# EAGLE design osc (EAGLE 9.5.2)
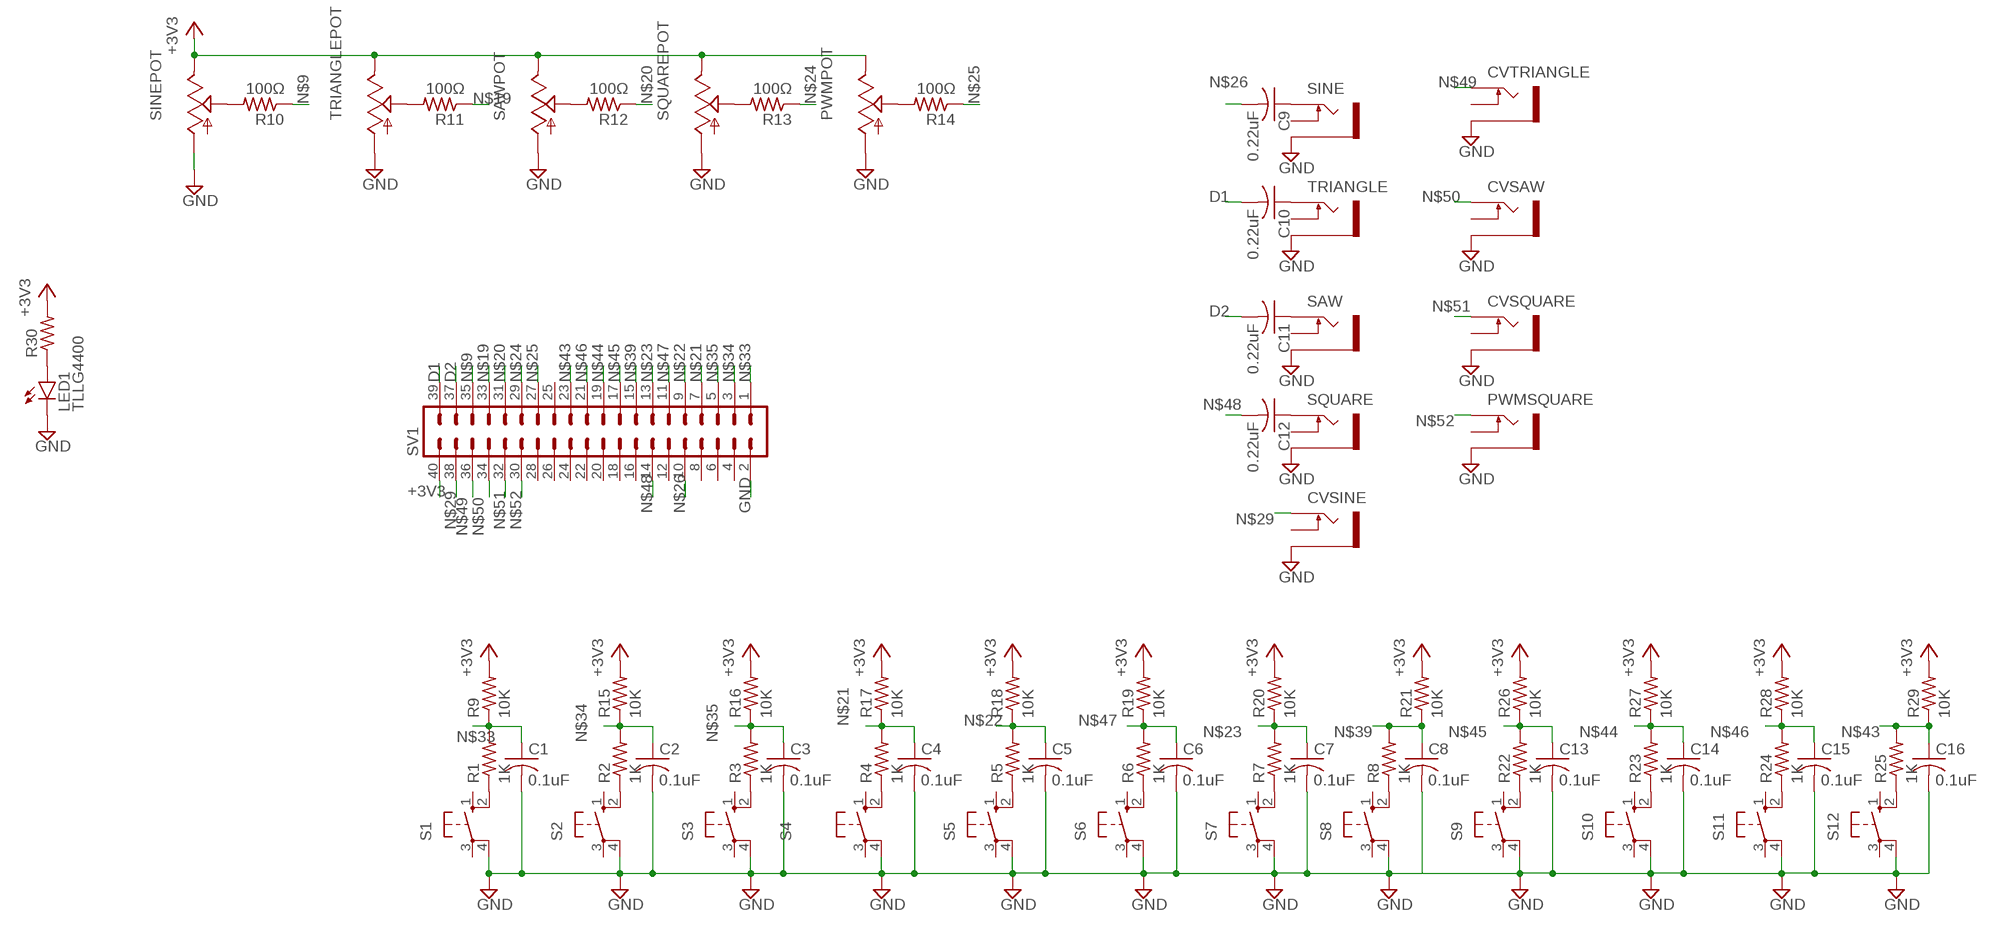
[diagram p0: schematic, sheet 1]

## Parts
C1  0.1uF  C-US025-024X044  [C025-024X044]
C2  0.1uF  C-US025-024X044  [C025-024X044]
C3  0.1uF  C-US025-024X044  [C025-024X044]
C4  0.1uF  C-US025-024X044  [C025-024X044]
C5  0.1uF  C-US025-024X044  [C025-024X044]
C6  0.1uF  C-US025-024X044  [C025-024X044]
C7  0.1uF  C-US025-024X044  [C025-024X044]
C8  0.1uF  C-US025-024X044  [C025-024X044]
C9  0.22uF  C-US025-024X044  [C025-024X044]
C10  0.22uF  C-US025-024X044  [C025-024X044]
C11  0.22uF  C-US025-024X044  [C025-024X044]
C12  0.22uF  C-US025-024X044  [C025-024X044]
C13  0.1uF  C-US025-024X044  [C025-024X044]
C14  0.1uF  C-US025-024X044  [C025-024X044]
C15  0.1uF  C-US025-024X044  [C025-024X044]
C16  0.1uF  C-US025-024X044  [C025-024X044]
CVSAW  THONKICONNNEW  [WQP-PJ301M-12_JACK]
CVSINE  THONKICONNNEW  [WQP-PJ301M-12_JACK]
CVSQUARE  THONKICONNNEW  [WQP-PJ301M-12_JACK]
CVTRIANGLE  THONKICONNNEW  [WQP-PJ301M-12_JACK]
LED1  TLLG4400  [LED3MM]
PWMPOT  9MM_SNAP-IN_POT_  [9MM_SNAP-IN_POT]
PWMSQUARE  THONKICONNNEW  [WQP-PJ301M-12_JACK]
R1  1K  R-US_0207/10  [0207/10]
R2  1K  R-US_0207/10  [0207/10]
R3  1K  R-US_0207/10  [0207/10]
R4  1K  R-US_0207/10  [0207/10]
R5  1K  R-US_0207/10  [0207/10]
R6  1K  R-US_0207/10  [0207/10]
R7  1K  R-US_0207/10  [0207/10]
R8  1K  R-US_0207/10  [0207/10]
R9  10K  R-US_0207/10  [0207/10]
R10  100Ω  R-US_0207/10  [0207/10]
R11  100Ω  R-US_0207/10  [0207/10]
R12  100Ω  R-US_0207/10  [0207/10]
R13  100Ω  R-US_0207/10  [0207/10]
R14  100Ω  R-US_0207/10  [0207/10]
R15  10K  R-US_0207/10  [0207/10]
R16  10K  R-US_0207/10  [0207/10]
R17  10K  R-US_0207/10  [0207/10]
R18  10K  R-US_0207/10  [0207/10]
R19  10K  R-US_0207/10  [0207/10]
R20  10K  R-US_0207/10  [0207/10]
R21  10K  R-US_0207/10  [0207/10]
R22  1K  R-US_0207/10  [0207/10]
R23  1K  R-US_0207/10  [0207/10]
R24  1K  R-US_0207/10  [0207/10]
R25  1K  R-US_0207/10  [0207/10]
R26  10K  R-US_0207/10  [0207/10]
R27  10K  R-US_0207/10  [0207/10]
R28  10K  R-US_0207/10  [0207/10]
R29  10K  R-US_0207/10  [0207/10]
R30  R-US_0207/10  [0207/10]
S1  10-XX  [B3F-10XX]
S2  10-XX  [B3F-10XX]
S3  10-XX  [B3F-10XX]
S4  10-XX  [B3F-10XX]
S5  10-XX  [B3F-10XX]
S6  10-XX  [B3F-10XX]
S7  10-XX  [B3F-10XX]
S8  10-XX  [B3F-10XX]
S9  10-XX  [B3F-10XX]
S10  10-XX  [B3F-10XX]
S11  10-XX  [B3F-10XX]
S12  10-XX  [B3F-10XX]
SAW  THONKICONNNEW  [WQP-PJ301M-12_JACK]
SAWPOT  9MM_SNAP-IN_POT_  [9MM_SNAP-IN_POT]
SINE  THONKICONNNEW  [WQP-PJ301M-12_JACK]
SINEPOT  9MM_SNAP-IN_POT_  [9MM_SNAP-IN_POT]
SQUARE  THONKICONNNEW  [WQP-PJ301M-12_JACK]
SQUAREPOT  9MM_SNAP-IN_POT_  [9MM_SNAP-IN_POT]
SV1  MA20-2  [MA20-2]
TRIANGLE  THONKICONNNEW  [WQP-PJ301M-12_JACK]
TRIANGLEPOT  9MM_SNAP-IN_POT_  [9MM_SNAP-IN_POT]

## Nets
+3V3: PWMPOT.3(E) R9.2 R15.2 R16.2 R17.2 R18.2 R19.2 R20.2 R21.2 R26.2 R27.2 R28.2 R29.2 R30.2 SAWPOT.3(E) SINEPOT.3(E) SQUAREPOT.3(E) SV1.40 TRIANGLEPOT.3(E)
D1: C10.2 SV1.39
D2: C11.2 SV1.37
GND: C1.2 C2.2 C3.2 C4.2 C5.2 C6.2 C7.2 C8.2 C13.2 C14.2 C15.2 C16.2 CVSAW.P$3_SLEEVE(SLEEVE) CVSINE.P$3_SLEEVE(SLEEVE) CVSQUARE.P$3_SLEEVE(SLEEVE) CVTRIANGLE.P$3_SLEEVE(SLEEVE) LED1.K(C) PWMPOT.1(A) PWMSQUARE.P$3_SLEEVE(SLEEVE) S1.4(P1) S2.4(P1) S3.4(P1) S4.4(P1) S5.4(P1) S6.4(P1) S7.4(P1) S8.4(P1) S9.4(P1) S10.4(P1) S11.4(P1) S12.4(P1) SAW.P$3_SLEEVE(SLEEVE) SAWPOT.1(A) SINE.P$3_SLEEVE(SLEEVE) SINEPOT.1(A) SQUARE.P$3_SLEEVE(SLEEVE) SQUAREPOT.1(A) SV1.2 TRIANGLE.P$3_SLEEVE(SLEEVE) TRIANGLEPOT.1(A)
N$1: R1.1 S1.2(S1)
N$2: R2.1 S2.2(S1)
N$3: R3.1 S3.2(S1)
N$4: R4.1 S4.2(S1)
N$5: R6.1 S6.2(S1)
N$6: R7.1 S7.2(S1)
N$7: R8.1 S8.2(S1)
N$8: R5.1 S5.2(S1)
N$9: R10.1 SV1.35
N$10: C9.1 SINE.P$1_TIP(TIP)
N$11: C10.1 TRIANGLE.P$1_TIP(TIP)
N$12: C11.1 SAW.P$1_TIP(TIP)
N$13: C12.1 SQUARE.P$1_TIP(TIP)
N$14: R10.2 SINEPOT.2(S)
N$15: R11.2 TRIANGLEPOT.2(S)
N$16: R12.2 SAWPOT.2(S)
N$17: R13.2 SQUAREPOT.2(S)
N$18: PWMPOT.2(S) R14.2
N$19: R11.1 SV1.33
N$20: R12.1 SV1.31
N$21: C4.1 R4.2 R17.1 SV1.7
N$22: C5.1 R5.2 R18.1 SV1.9
N$23: C7.1 R7.2 R20.1 SV1.13
N$24: R13.1 SV1.29
N$25: R14.1 SV1.27
N$26: C9.2 SV1.10
N$27: LED1.A R30.1
N$29: CVSINE.P$1_TIP(TIP) SV1.38
N$33: C1.1 R1.2 R9.1 SV1.1
N$34: C2.1 R2.2 R15.1 SV1.3
N$35: C3.1 R3.2 R16.1 SV1.5
N$38: R23.1 S10.2(S1)
N$39: C8.1 R8.2 R21.1 SV1.15
N$40: R24.1 S11.2(S1)
N$41: R25.1 S12.2(S1)
N$42: R22.1 S9.2(S1)
N$43: C16.1 R25.2 R29.1 SV1.23
N$44: C14.1 R23.2 R27.1 SV1.19
N$45: C13.1 R22.2 R26.1 SV1.17
N$46: C15.1 R24.2 R28.1 SV1.21
N$47: C6.1 R6.2 R19.1 SV1.11
N$48: C12.2 SV1.14
N$49: CVTRIANGLE.P$1_TIP(TIP) SV1.36
N$50: CVSAW.P$1_TIP(TIP) SV1.34
N$51: CVSQUARE.P$1_TIP(TIP) SV1.32
N$52: PWMSQUARE.P$1_TIP(TIP) SV1.30
Unconnected: CVSAW.P$2_SWITCH(SWITCH) CVSINE.P$2_SWITCH(SWITCH) CVSQUARE.P$2_SWITCH(SWITCH) CVTRIANGLE.P$2_SWITCH(SWITCH) PWMSQUARE.P$2_SWITCH(SWITCH) S1.1(S) S1.3(P) S2.1(S) S2.3(P) S3.1(S) S3.3(P) S4.1(S) S4.3(P) S5.1(S) S5.3(P) S6.1(S) S6.3(P) S7.1(S) S7.3(P) S8.1(S) S8.3(P) S9.1(S) S9.3(P) S10.1(S) S10.3(P) S11.1(S) S11.3(P) S12.1(S) S12.3(P) SAW.P$2_SWITCH(SWITCH) SINE.P$2_SWITCH(SWITCH) SQUARE.P$2_SWITCH(SWITCH) SV1.4 SV1.6 SV1.8 SV1.12 SV1.16 SV1.18 SV1.20 SV1.22 SV1.24 SV1.25 SV1.26 SV1.28 TRIANGLE.P$2_SWITCH(SWITCH)

## Library data of the parts
C1-C16 = rcl:C-US: CAPACITOR, American symbol; SPICEPREFIX: C
CVSAW CVSINE CVSQUARE CVTRIANGLE PWMSQUARE SAW SINE SQUARE TRIANGLE = MusicThingModular:THONKICONN: 3.5mm socket for Eurorack modular synths
LED1 = led:TLLG4400: Low Current (2mA) LED 3 mm Tinted Diffused Package color GREEN Source: Data sheet <http://www.farnell.com/datasheets/391098.pdf>; MF: VISHAY SEMICONDUCTOR; OC_FARNELL: 1612435
PWMPOT SAWPOT SINEPOT SQUAREPOT TRIANGLEPOT = MusicThingModular:9MM_SNAP-IN_POT: 9mm vertical snap-in pot, Alpha / Panasonic style
R1-R30 = rcl:R-US_: RESISTOR, American symbol; SPICEPREFIX: R
S1-S12 = switch-omron:10-XX: OMRON SWITCH; MPN: B3F-1000; OC_FARNELL: 176432; OC_NEWARK: 36M3542
SV1 = con-lstb:MA20-2: PIN HEADER; OC_FARNELL: unknown; OC_NEWARK: unknown

## Board
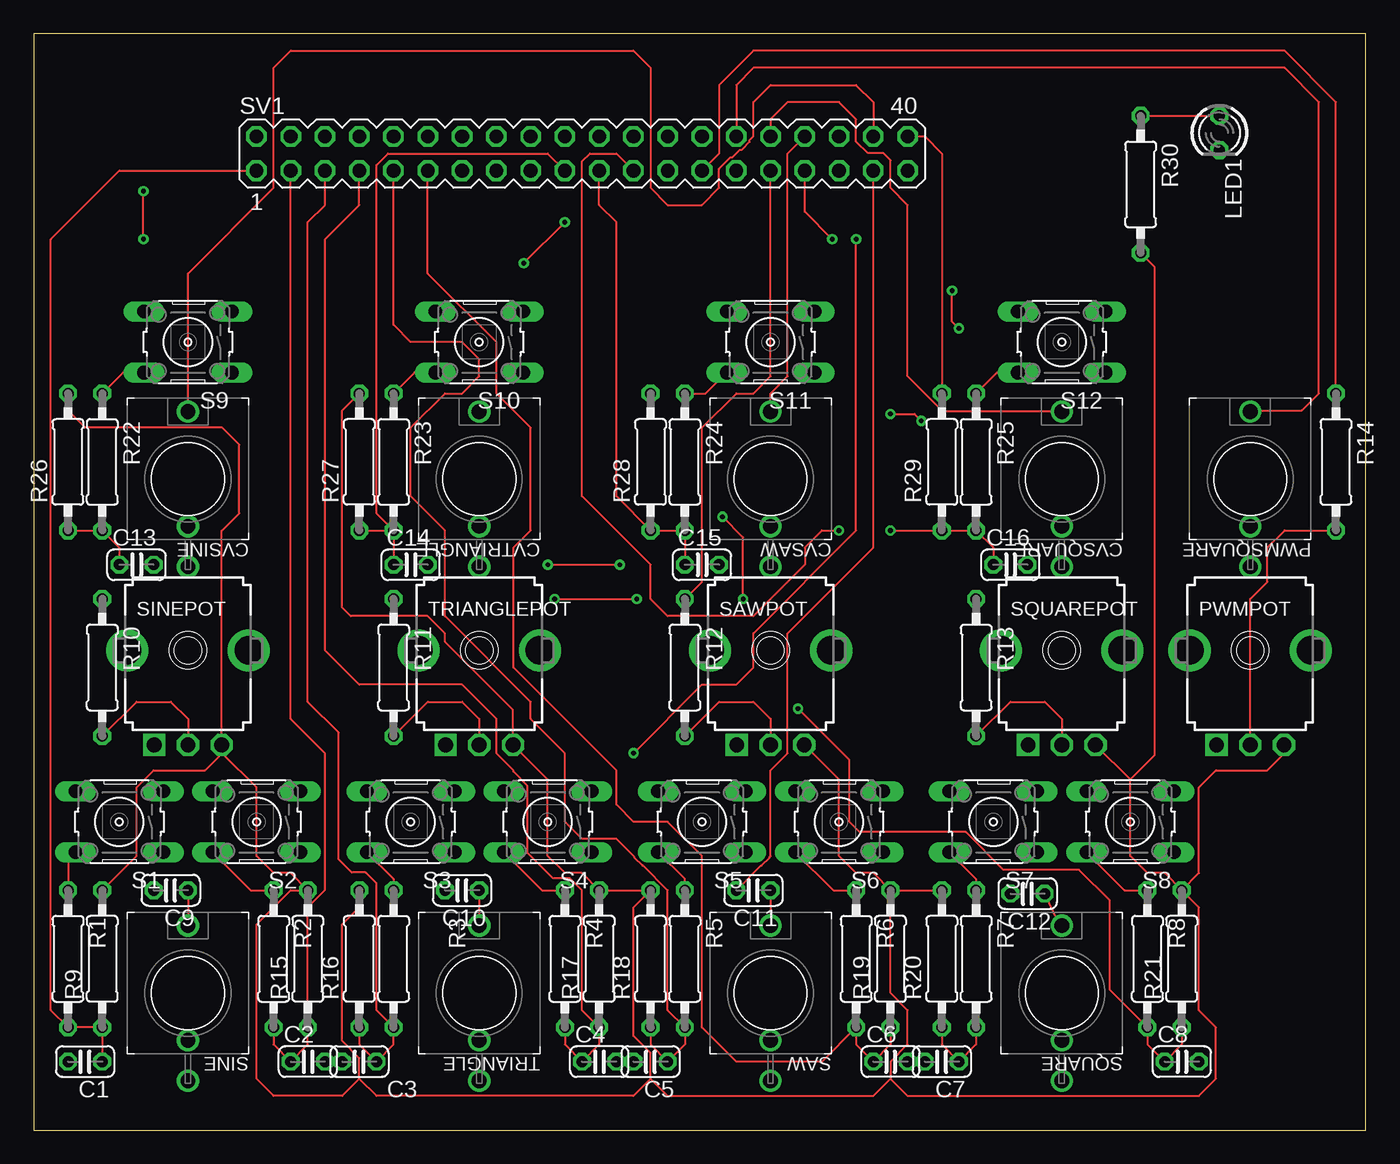
[diagram p1: board, top side]
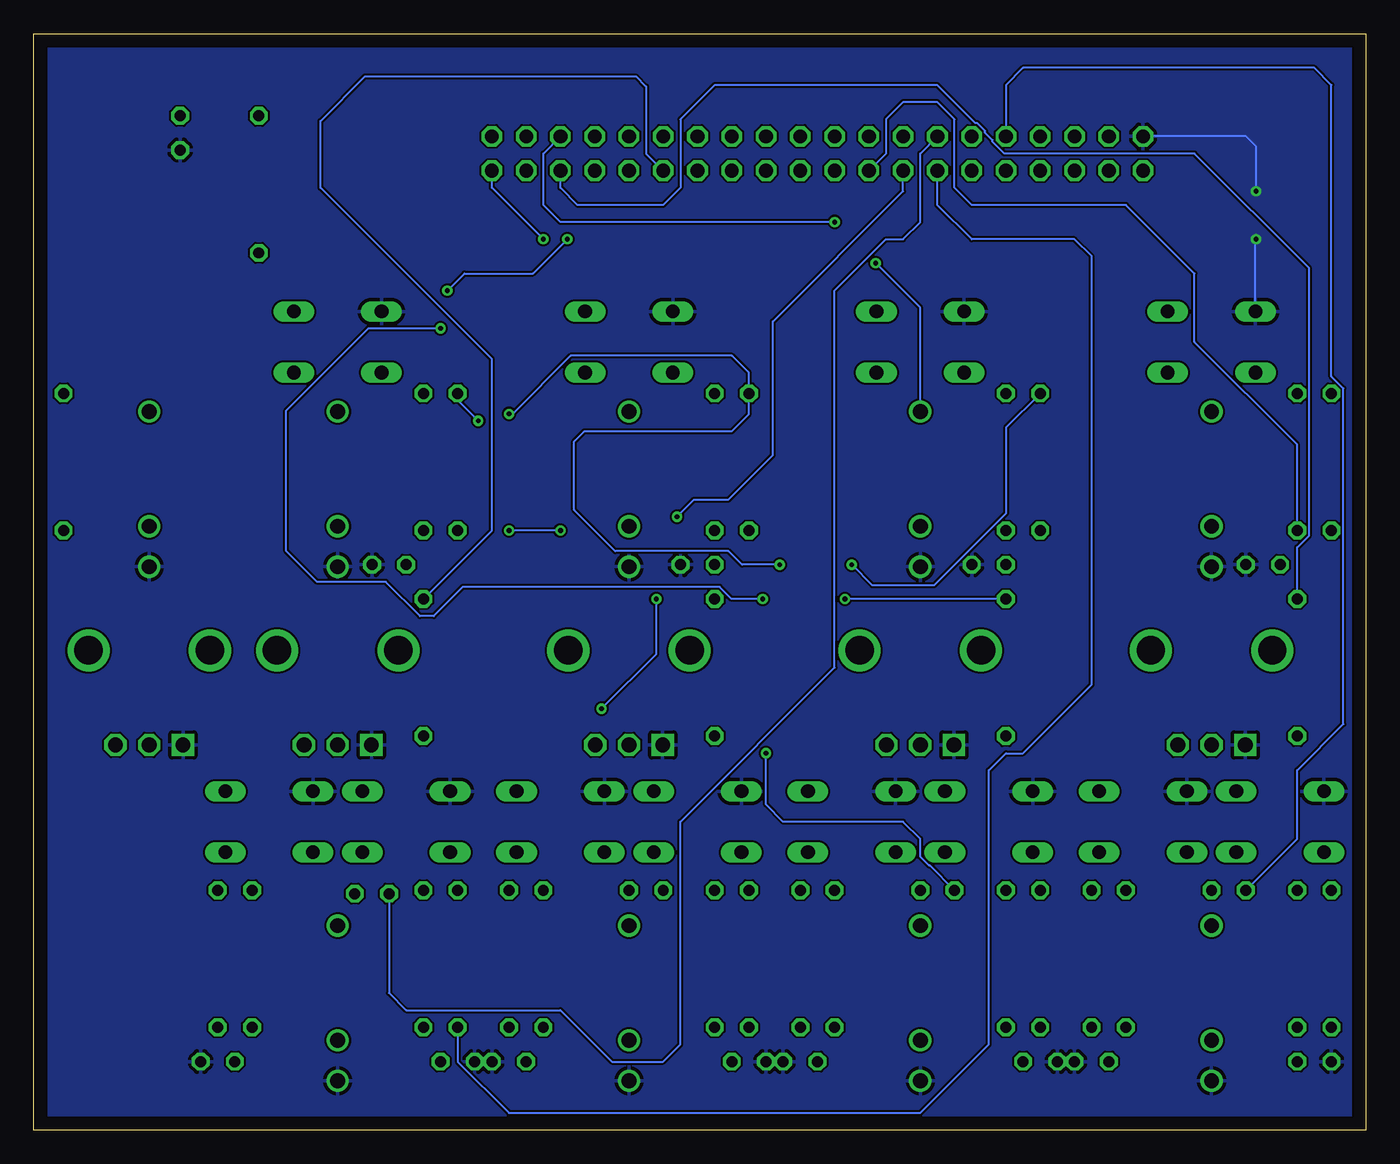
[diagram p2: board, bottom side, seen from below]

Size 98.73 x 81.27 mm. Coordinates in mm from the lower left corner, seen from the top.
Outline: 0,0 98.73,0 98.73,81.27 0,81.27 0,0
Copper layers (1*16): Top 0.035mm / dielectric 1.5mm / Bottom 0.035mm
Design rules "default": minimum track width 6mil, minimum drill 0.35mm, track to track 6mil, track to pad 6mil, pad to pad 6mil, via to via 6mil, smd to smd 6mil, copper to edge 40mil, drill to drill 6mil, minimum pad ring 10mil, minimum via ring 8mil, stop-mask expansion 4mil, vias tented up to drill 0mil, thermal gap 10mil

### Footprints (pad centres in the part's own frame; a part is rotated, then mirrored left to right if it is on the bottom)
C025-024X044 = drill 0.813 octagon: 1 -1.27,0; 2 1.27,0
WQP-PJ301M-12_JACK = drill 1.1: P$1_TIP 0,5; P$2_SWITCH 0,-3.5; P$3_SLEEVE 0,-6.5
LED3MM = drill 0.813 octagon: A -1.27,0; K 1.27,0
9MM_SNAP-IN_POT = drill 1.1 square: 1 -2.5,-7 | drill 1.1 octagon: 2 0,-7; 3 2.5,-7 | drill 2.1 pad 2.794: CHASSIS1 -4.5,0; CHASSIS2 4.5,0
0207/10 = drill 0.813 octagon: 1 -5.08,0; 2 5.08,0
B3F-10XX = drill 1.016 long: 1 -3.251,2.261; 2 3.251,2.261; 3 -3.251,-2.261; 4 3.251,-2.261
MA20-2 = drill 1.016 octagon: 1 -24.13,-1.27; 2 -24.13,1.27; 3 -21.59,-1.27; 4 -21.59,1.27; 5 -19.05,-1.27; 6 -19.05,1.27; 7 -16.51,-1.27; 8 -16.51,1.27; 9 -13.97,-1.27; 10 -13.97,1.27; 11 -11.43,-1.27; 12 -11.43,1.27; 13 -8.89,-1.27; 14 -8.89,1.27; 15 -6.35,-1.27; 16 -6.35,1.27; 17 -3.81,-1.27; 18 -3.81,1.27; 19 -1.27,-1.27; 20 -1.27,1.27; 21 1.27,-1.27; 22 1.27,1.27; 23 3.81,-1.27; 24 3.81,1.27; 25 6.35,-1.27; 26 6.35,1.27; 27 8.89,-1.27; 28 8.89,1.27; 29 11.43,-1.27; 30 11.43,1.27; 31 13.97,-1.27; 32 13.97,1.27; 33 16.51,-1.27; 34 16.51,1.27; 35 19.05,-1.27; 36 19.05,1.27; 37 21.59,-1.27; 38 21.59,1.27; 39 24.13,-1.27; 40 24.13,1.27

### Placement (x,y rotation side)
C1  3.81,5.08 180 top
C2  20.32,5.08 0 top
C3  24.13,5.08 180 top
C4  41.91,5.08 0 top
C5  45.72,5.08 180 top
C6  63.5,5.08 0 top
C7  67.31,5.08 180 top
C8  85.09,5.08 0 top
C9  10.16,17.78 180 top
C10  31.75,17.78 180 top
C11  53.34,17.78 180 top
C12  73.66,17.53 180 top
C13  7.62,41.91 0 top
C14  27.94,41.91 0 top
C15  49.53,41.91 0 top
C16  72.39,41.91 0 top
CVSAW  54.61,48.26 0 top
CVSINE  11.43,48.26 0 top
CVSQUARE  76.2,48.26 0 top
CVTRIANGLE  33.02,48.26 0 top
LED1  87.88,73.91 270 top
PWMPOT  90.17,35.56 0 top
PWMSQUARE  90.17,48.26 0 top
R1  2.54,12.7 270 top
R2  17.78,12.7 270 top
R3  26.67,12.7 270 top
R4  39.37,12.7 270 top
R5  48.26,12.7 270 top
R6  60.96,12.7 270 top
R7  69.85,12.7 270 top
R8  82.55,12.7 270 top
R9  5.08,12.7 90 top
R10  5.08,34.29 270 top
R11  26.67,34.29 270 top
R12  48.26,34.29 270 top
R13  69.85,34.29 270 top
R14  96.52,49.53 270 top
R15  20.32,12.7 90 top
R16  24.13,12.7 90 top
R17  41.91,12.7 90 top
R18  45.72,12.7 90 top
R19  63.5,12.7 90 top
R20  67.31,12.7 90 top
R21  85.09,12.7 90 top
R22  5.08,49.53 270 top
R23  26.67,49.53 270 top
R24  48.26,49.53 270 top
R25  69.85,49.53 270 top
R26  2.54,49.53 90 top
R27  24.13,49.53 90 top
R28  45.72,49.53 90 top
R29  67.31,49.53 90 top
R30  82.04,70.1 270 top
S1  6.35,22.86 180 top
S2  16.51,22.86 180 top
S3  27.94,22.86 180 top
S4  38.1,22.86 180 top
S5  49.53,22.86 180 top
S6  59.69,22.86 180 top
S7  71.12,22.86 180 top
S8  81.28,22.86 180 top
S9  11.43,58.42 180 top
S10  33.02,58.42 180 top
S11  54.61,58.42 180 top
S12  76.2,58.42 180 top
SAW  54.61,10.16 0 top
SAWPOT  54.61,35.56 0 top
SINE  11.43,10.16 0 top
SINEPOT  11.43,35.56 0 top
SQUARE  76.2,10.16 0 top
SQUAREPOT  76.2,35.56 0 top
SV1  40.64,72.39 0 top
TRIANGLE  33.02,10.16 0 top
TRIANGLEPOT  33.02,35.56 0 top

### Tracks (layer width: path | path; a pad name or v marks a point on that pad's centre or on a via)
+3V3  (via drill 0.35)
  Top 0.152: R19.2 R20.2 | 13.93,27.94 SINEPOT.3 13.93,44.41 15.24,45.72 15.24,50.8 13.97,52.07 3.81,52.07 2.54,53.34 R26.2 | 13.93,27.94 13.93,27.9 12.7,26.67 8.89,26.67 7.62,25.4 7.62,20.32 R9.2 | 13.93,27.94 13.97,27.94 16.51,25.4 16.51,20.32 17.78,19.05 19.05,19.05 R15.2 19.05,17.78 16.51,15.24 16.51,3.81 17.78,2.54 22.86,2.54 24.13,3.81 | R19.2 62.23,19.05 60.96,19.05 59.69,20.32 59.69,25.98 SAWPOT.3 | R21.2 83.82,19.05 82.55,19.05 81.28,20.32 81.28,25.98 | 81.28,25.98 SQUAREPOT.3 | R19.2 63.5,10.16 64.77,8.89 64.77,6.35 63.5,5.08 63.5,3.81 | 45.72,3.81 46.99,2.54 62.23,2.54 63.5,3.81 | 45.72,3.81 45.72,5.71 44.45,6.99 44.45,16.51 R18.2 R17.2 40.64,19.05 39.37,19.05 38.1,20.32 38.1,25.98 TRIANGLEPOT.3 35.52,31.16 30.48,36.2 30.48,36.83 29.21,38.1 23.5,38.1 22.86,38.73 22.86,53.34 R27.2 | SV1.40 66.04,73.66 67.31,72.39 R29.2 | 63.5,3.81 64.77,2.54 86.36,2.54 87.63,3.81 87.63,7.62 86.36,8.89 86.36,16.51 R21.2 | 45.72,3.81 44.45,2.54 25.4,2.54 24.13,3.81 | 24.13,3.81 24.13,5.33 22.86,6.6 22.86,15.24 24.13,16.51 R16.2 | R21.2 86.36,19.05 86.36,25.4 87.63,26.67 91.44,26.67 92.67,27.9 PWMPOT.3 | v38.1,41.91 v43.43,41.91 | v63.5,53.09 65.28,53.09 v65.79,52.58 | R30.2 83.06,64.01 83.06,27.76 81.28,25.98
  Bottom 0.152: R27.2 26.67,52.07 26.67,45.72 32,40.39 36.58,40.39 v38.1,41.91 | v43.43,41.91 46.23,41.91 47.24,42.93 55.63,42.93 58.67,45.97 58.67,51.05 57.91,51.82 46.99,51.82 45.72,53.09 R28.2 45.72,56.13 46.99,57.4 58.93,57.4 63.25,53.09 v63.5,53.09 | v65.79,52.58 67.31,54.1 R29.2
D1  (via drill 0.35)
  Top 0.152: v44.45,27.94 49.53,33.02 52.07,33.02 53.34,34.29 53.34,36.83 60.96,44.45 v60.96,66.04
  Bottom 0.152: C10.2 32.31,19.61 32.36,19.61 33.02,20.27 33.02,21.59 34.29,22.86 43.18,22.86 44.45,24.13 v44.45,27.94 | v60.96,66.04 64.77,69.85 SV1.39
D2
  Top 0.152: C11.2 53.9,19.61 53.95,19.61 54.53,20.19 54.53,20.24 54.61,20.32 54.61,26.67 55.88,27.94 55.88,36.83 62.23,43.18 SV1.37
GND  (via drill 0.35)
  Top 0.152: v8.13,66.04 v8.13,69.6
  Bottom 0.152: S9.4 8.18,65.99 v8.13,66.04 | v8.13,69.6 8.13,72.9 8.89,73.66 SV1.2
  pour Bottom: 0,81.28 98.81,81.28 98.81,0 0,0
N$1
  Top 0.152: S1.2 2.54,20.04 R1.1
N$2
  Top 0.152: S2.2 16.08,17.78 R2.1
N$3
  Top 0.152: S3.2 26.67,18.62 R3.1
N$4
  Top 0.152: S4.2 37.67,17.78 R4.1
N$5
  Top 0.152: S6.2 59.26,17.78 R6.1
N$6
  Top 0.152: S7.2 69.85,18.62 R7.1
N$7
  Top 0.152: S8.2 80.85,17.78 R8.1
N$8
  Top 0.152: R5.1 48.26,18.62 S5.2
N$9
  Bottom 0.152: R10.1 5.08,43.19 4.19,44.08 4.19,63.88 12.7,72.39 26.8,72.39 27.66,73.25 27.66,73.38 28.22,73.94 28.22,74.07 28.8,74.65 28.93,74.65 31.75,77.47 48.26,77.47 50.8,74.93 50.8,69.85 52.07,68.58 58.42,68.58 59.69,69.85 SV1.35
N$10
  Top 0.152: C9.1 SINE.P$1_TIP
N$11
  Top 0.152: C10.1 TRIANGLE.P$1_TIP
N$12
  Top 0.152: C11.1 SAW.P$1_TIP
N$13
  Top 0.152: C12.1 75.96,15.4 SQUARE.P$1_TIP
N$14
  Top 0.152: R10.2 7.62,31.75 10.16,31.75 11.43,30.48 SINEPOT.2
N$15
  Top 0.152: R11.2 29.21,31.75 31.75,31.75 33.02,30.48 TRIANGLEPOT.2
N$16
  Top 0.152: R12.2 50.8,31.75 53.34,31.75 54.61,30.48 SAWPOT.2
N$17
  Top 0.152: R13.2 72.39,31.75 74.93,31.75 76.2,30.48 SQUAREPOT.2
N$18
  Top 0.152: PWMPOT.2 90.17,39.37 91.44,40.64 91.44,43.18 92.71,44.45 R14.2
N$19  (via drill 0.35)
  Top 0.152: v68.58,59.44 68.07,59.94 v68.07,62.23 | v59.18,66.04 57.15,68.07 SV1.33 | v38.61,39.37 v44.7,39.37
  Bottom 0.152: R11.1 v38.61,39.37 | v44.7,39.37 47,39.37 47.89,40.26 66.93,40.26 69.09,38.1 70.1,38.1 72.64,40.64 77.72,40.64 80.01,42.93 80.01,53.34 73.91,59.44 v68.58,59.44 | v68.07,62.23 66.8,63.5 61.72,63.5 v59.18,66.04
N$20
  Top 0.152: R12.1 49.53,40.64 49.53,52.07 52.07,54.61 53.34,54.61 54.61,55.88 SV1.31
N$21
  Top 0.152: R4.2 39.37,6.35 C4.1 41.91,6.35 R17.1 40.64,8.89 40.64,17.77 39.74,18.67 38.48,18.67 36.6,20.55 36.6,25.53 35.56,26.57 35.56,26.67 34.29,27.94 34.29,30.48 31.75,33.02 24.13,33.02 21.59,35.56 21.59,66.04 24.13,68.58 SV1.7
N$22
  Top 0.152: R18.1 45.72,6.35 C5.1 48.26,6.35 R5.2 46.99,8.89 46.99,17.78 45.16,19.61 45.11,19.61 44.53,20.19 44.53,20.24 43.18,21.59 40.64,21.59 39.37,22.86 39.37,27.94 36.83,30.48 36.83,31.75 30.48,38.1 30.48,44.45 27.94,46.99 27.94,52.07 30.48,54.61 31.75,54.61 33.02,55.88 33.02,57.15 31.75,58.42 27.94,58.42 26.67,59.69 SV1.9
N$23
  Top 0.152: R7.2 69.85,6.35 C7.1 67.31,6.35 R20.1
  Bottom 0.152: R20.1 67.31,5.08 63.5,1.27 33.02,1.27 27.94,6.35 27.94,26.67 26.67,27.94 25.4,27.94 20.32,33.02 20.32,64.77 21.59,66.04 29.21,66.04 31.75,68.58 SV1.13
N$24
  Bottom 0.152: R13.1 64.77,44.45 64.77,57.15 77.47,69.85 77.47,74.8 74.17,78.11 54.1,78.11 53.34,77.34 53.34,72.39 SV1.29
N$25
  Top 0.152: R14.1 96.52,76.2 92.71,80.01 53.34,80.01 50.8,77.47 50.8,72.39 SV1.27
N$26
  Bottom 0.152: C9.2 5.08,21.59 5.08,26.67 1.65,30.1 1.65,54.98 2.54,55.87 2.54,77.47 3.81,78.74 25.4,78.74 26.67,77.47 SV1.10
N$27
  Top 0.152: R30.1 LED1.A
N$29
  Top 0.152: CVSINE.P$1_TIP 11.43,63.5 17.78,69.85 17.78,78.74 19.05,80.01 44.45,80.01 45.72,78.74 45.72,69.85 46.99,68.58 49.53,68.58 50.8,69.85 50.8,71.25 51.66,72.11 51.79,72.11 52.35,72.67 52.48,72.67 53.06,73.25 53.06,73.38 53.34,73.66 53.34,76.2 54.61,77.47 60.96,77.47 62.23,76.2 SV1.38
N$33
  Top 0.152: C1.1 R9.1 R1.2 1.27,8.89 1.27,66.04 6.35,71.12 SV1.1
N$34
  Top 0.152: R2.2 17.78,6.35 C2.1 20.32,6.35 R15.1 20.32,16.52 21.59,17.79 21.59,27.94 19.05,30.48 SV1.3
N$35
  Top 0.152: R16.1 24.13,6.35 C3.1 26.67,6.35 R3.2 25.4,8.89 25.4,18.29 24.59,19.1 23.57,19.1 22.61,20.07 22.61,29.46 20.32,31.75 20.32,67.31 21.59,68.58 SV1.5
N$38
  Top 0.152: R23.1 28.22,56.16 S10.2
N$39  (via drill 0.35)
  Top 0.152: R21.1 85.09,6.35 C8.1 82.55,6.35 R8.2 79.76,10.41 79.76,17.02 77.47,19.3 71.88,19.3 69.09,22.1 61.21,22.1 60.45,22.86 60.45,27.43 v56.64,31.24 | v52.58,39.37 52.58,43.94 v51.05,45.47
  Bottom 0.152: v56.64,31.24 52.58,35.31 v52.58,39.37 | v51.05,45.47 49.78,46.74 47.24,46.74 43.94,50.04 43.94,59.94 34.29,69.6 SV1.15
N$40
  Top 0.152: R24.1 49.81,54.61 S11.2
N$41
  Top 0.152: R25.1 71.4,56.16 S12.2
N$42
  Top 0.152: R22.1 6.63,56.16 S9.2
N$43  (via drill 0.35)
  Top 0.152: C16.1 71.12,43.18 R25.2 R29.1 v63.5,44.45 | SV1.23 43.18,72.39 41.22,72.39 40.64,71.81 40.64,46.99 45.72,41.91 45.72,39.37 46.99,38.1 53.34,38.1 57.15,41.91 57.15,43.18 58.42,44.45 v59.69,44.45
  Bottom 0.152: v59.69,44.45 v63.5,44.45
N$44
  Top 0.152: R27.1 R23.2 | R23.2 C14.1 | SV1.19 38.1,72.39 26.26,72.39 25.4,71.53 25.4,45.72 R23.2
N$45
  Top 0.152: R26.1 R22.2 6.35,43.18 C13.1
  Bottom 0.152: R22.2 5.08,50.8 12.7,58.42 12.7,63.5 17.78,68.58 29.21,68.58 30.48,69.85 30.48,74.93 31.75,76.2 34.29,76.2 35.56,74.93 35.56,72.39 SV1.17
N$46
  Top 0.152: C15.1 R24.2 R28.1 43.18,46.99 43.18,67.31 41.91,68.58 SV1.21
N$47
  Top 0.152: R19.1 63.5,6.35 C6.1 60.96,6.35 R6.2 58.42,5.08 52.07,5.08 49.53,7.62 49.53,20.32 46.99,22.86 44.45,22.86 43.18,24.13 43.18,26.67 35.56,34.29 35.56,43.18 36.83,44.45 36.83,52.07 34.29,54.61 34.29,58.42 29.21,63.5 SV1.11
N$48
  Bottom 0.152: C12.2 72.39,10.16 71.12,8.89 59.69,8.89 55.88,5.08 52.07,5.08 50.8,6.35 50.8,22.86 39.37,34.29 39.37,62.23 35.56,66.04 34.29,66.04 33.02,67.31 33.02,72.39 SV1.14
N$49  (via drill 0.35)
  Top 0.152: v36.32,64.26 v39.37,67.31
  Bottom 0.152: CVTRIANGLE.P$1_TIP 33.02,60.96 v36.32,64.26 | v39.37,67.31 59.69,67.31 60.96,68.58 60.96,72.39 SV1.36
N$50
  Top 0.152: CVSAW.P$1_TIP 54.61,54.61 55.88,55.88 55.88,72.39 SV1.34
N$51
  Top 0.152: CVSQUARE.P$1_TIP 67.39,53.26 64.77,55.88 64.77,68.58 63.5,69.85 63.5,71.89 62.97,72.42 61.82,72.42 60.96,73.28 60.96,74.93 59.69,76.2 55.88,76.2 54.61,74.93 SV1.32
N$52
  Top 0.152: PWMSQUARE.P$1_TIP 90.25,53.34 93.98,53.34 95.25,54.61 95.25,76.2 92.71,78.74 53.34,78.74 52.07,77.47 SV1.30